# EAGLE design pcb_main (EAGLE 9.6.2)
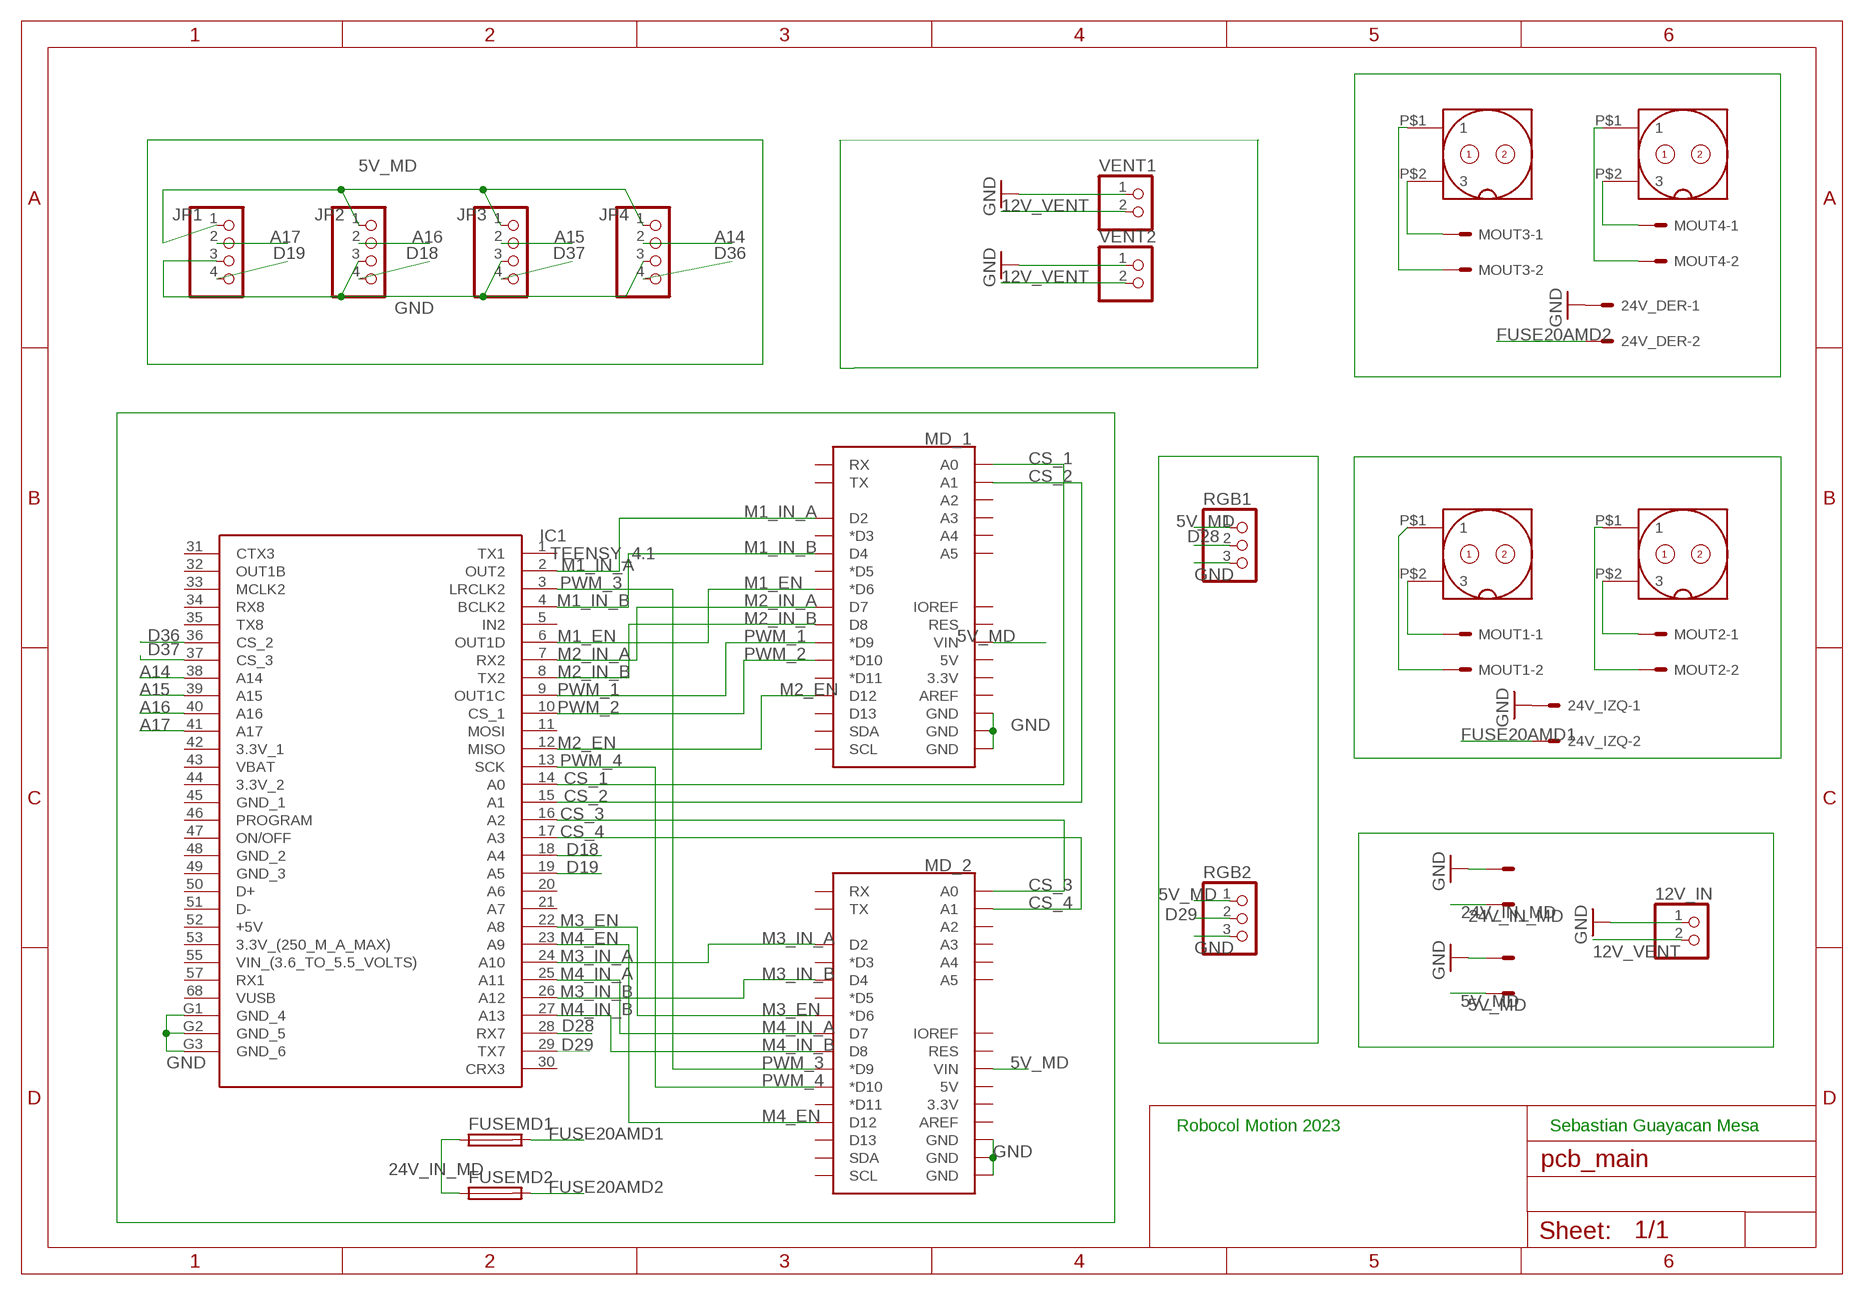
[diagram p0: schematic, sheet 1]

## Parts
5_MD  5566-25569-2  [5569-2]
12V_IN  PINHD-1X2  [1X02]
24V_DER  5566-25569-2  [5569-2]
24V_IZQ  5566-25569-2  [5569-2]
24V_MD  5566-25569-2  [5569-2]
FUSEMD1  FUSEBLANK_5X20MM  [FUSE_HOLDER_5X20MM]
FUSEMD2  FUSEBLANK_5X20MM  [FUSE_HOLDER_5X20MM]
IC1  TEENSY_4.1  [TEENSY41]
JP1  PINHD-1X4  [1X04]
JP2  PINHD-1X4  [1X04]
JP3  PINHD-1X4  [1X04]
JP4  PINHD-1X4  [1X04]
M1  GX16_2_PINS  [GX16_2_PINS_PADS]
M2  GX16_2_PINS  [GX16_2_PINS_PADS]
M3  GX16_2_PINS  [GX16_2_PINS_PADS]
M4  GX16_2_PINS  [GX16_2_PINS_PADS]
MD_1  ARDUINO_UNO_R3_SHIELDBASIC  [UNO_R3_SHIELD]
MD_2  ARDUINO_UNO_R3_SHIELDBASIC  [UNO_R3_SHIELD]
MOUT1  5566-25569-2  [5569-2]
MOUT2  5566-25569-2  [5569-2]
MOUT3  5566-25569-2  [5569-2]
MOUT4  5566-25569-2  [5569-2]
RGB1  PINHD-1X3  [1X03]
RGB2  PINHD-1X3  [1X03]
VENT1  PINHD-1X2  [1X02]
VENT2  PINHD-1X2  [1X02]

## Nets
5V_MD: 5_MD.2 JP1.1 JP2.1 JP3.1 JP4.1 MD_1.VIN MD_2.VIN RGB1.1 RGB2.1
12V_VENT: 12V_IN.2 VENT1.2 VENT2.2
24V_IN_MD: 24V_MD.2 FUSEMD1.1 FUSEMD2.1
A14: IC1.38(A14) JP4.2
A15: IC1.39(A15) JP3.2
A16: IC1.40(A16) JP2.2
A17: IC1.41(A17) JP1.2
CS_1: IC1.14(A0) MD_1.A0
CS_2: IC1.15(A1) MD_1.A1
CS_3: IC1.16(A2) MD_2.A0
CS_4: IC1.17(A3) MD_2.A1
D18: IC1.18(A4) JP2.4
D19: IC1.19(A5) JP1.4
D28: IC1.28(RX7) RGB1.2
D29: IC1.29(TX7) RGB2.2
D36: IC1.36(CS_2) JP4.4
D37: IC1.37(CS_3) JP3.4
FUSE20AMD1: 24V_IZQ.2 FUSEMD1.2
FUSE20AMD2: 24V_DER.2 FUSEMD2.2
GND: 5_MD.1 12V_IN.1 24V_DER.1 24V_IZQ.1 24V_MD.1 IC1.G1(GND_4) IC1.G2(GND_5) IC1.G3(GND_6) JP1.3 JP2.3 JP3.3 JP4.3 MD_1.GND@0(GND) MD_1.GND@1(GND) MD_1.GND@2(GND) MD_2.GND@0(GND) MD_2.GND@1(GND) MD_2.GND@2(GND) RGB1.3 RGB2.3 VENT1.1 VENT2.1
M1_EN: IC1.6(OUT1D) MD_1.D6(*D6)
M1_IN_A: IC1.2(OUT2) MD_1.D2
M1_IN_B: IC1.4(BCLK2) MD_1.D4
M2_EN: IC1.12(MISO) MD_1.D12
M2_IN_A: IC1.7(RX2) MD_1.D7
M2_IN_B: IC1.8(TX2) MD_1.D8
M3_EN: IC1.22(A8) MD_2.D6(*D6)
M3_IN_A: IC1.24(A10) MD_2.D2
M3_IN_B: IC1.26(A12) MD_2.D4
M4_EN: IC1.23(A9) MD_2.D12
M4_IN_A: IC1.25(A11) MD_2.D7
M4_IN_B: IC1.27(A13) MD_2.D8
N$3: M1.P$2 MOUT1.1
N$4: M2.P$2 MOUT2.1
N$5: M2.P$1 MOUT2.2
N$6: M1.P$1 MOUT1.2
N$7: M4.P$2 MOUT4.1
N$8: M4.P$1 MOUT4.2
N$9: M3.P$2 MOUT3.1
N$10: M3.P$1 MOUT3.2
PWM_1: IC1.9(OUT1C) MD_1.D9(*D9)
PWM_2: IC1.10(CS_1) MD_1.D10(*D10)
PWM_3: IC1.3(LRCLK2) MD_2.D9(*D9)
PWM_4: IC1.13(SCK) MD_2.D10(*D10)
Unconnected: IC1.1(TX1) IC1.5(IN2) IC1.11(MOSI) IC1.20(A6) IC1.21(A7) IC1.30(CRX3) IC1.31(CTX3) IC1.32(OUT1B) IC1.33(MCLK2) IC1.34(RX8) IC1.35(TX8) IC1.42(3.3V_1) IC1.43(VBAT) IC1.44(3.3V_2) IC1.45(GND_1) IC1.46(PROGRAM) IC1.47(ON/OFF) IC1.48(GND_2) IC1.49(GND_3) IC1.50(D+) IC1.51(D-) IC1.52(+5V) IC1.53(3.3V_(250_M_A_MAX)) IC1.55(VIN_(3.6_TO_5.5_VOLTS)) IC1.57(RX1) IC1.68(VUSB) MD_1.3.3V MD_1.5V MD_1.A2 MD_1.A3 MD_1.A4 MD_1.A5 MD_1.AREF MD_1.D3(*D3) MD_1.D5(*D5) MD_1.D11(*D11) MD_1.D13 MD_1.IOREF MD_1.RES MD_1.RX MD_1.SCL MD_1.SDA MD_1.TX MD_2.3.3V MD_2.5V MD_2.A2 MD_2.A3 MD_2.A4 MD_2.A5 MD_2.AREF MD_2.D3(*D3) MD_2.D5(*D5) MD_2.D11(*D11) MD_2.D13 MD_2.IOREF MD_2.RES MD_2.RX MD_2.SCL MD_2.SDA MD_2.TX

## Notes on the sheet
- Robocol Motion 2023 | Sebastian Guayacan Mesa

## Library data of the parts
5_MD 24V_DER 24V_IZQ 24V_MD MOUT1-MOUT4 = molex_arreglado_2:5566-2: Mini FIT connector 2 pol Source: http://www.molex.com
12V_IN VENT1 VENT2 = pinhead:PINHD-1X2: PIN HEADER
FUSEMD1 FUSEMD2 = fuse:FUSE: Fuse; OC_FARNELL: unknown; OC_NEWARK: unknown
IC1 = TEENSY_4.1:TEENSY_4.1: Teensy 4.1 Development Board Source: Datasheet <https://www.pjrc.com/store/teensy41.html>; DESCRIPTION: Teensy 4.1 Development Board; HEIGHT: 4.07mm; MANUFACTURER_NAME: PJRC; MANUFACTURER_PART_NUMBER: TEENSY 4.1
JP1-JP4 = pinhead:PINHD-1X4: PIN HEADER
M1-M4 = Robocol_Eagle_Libraries2:GX16_2_PINS: GX19 Reference: GX19 2 pins Type: Male Connector. Description: Aviation connector use for power connections. Rated Current: 7A Maximum working Voltage: 250 V AC RMS Author: Franz Luepke. Year: 2020 Made for use in: Robocol Uniandes.
MD_1 MD_2 = SparkFun-Boards:ARDUINO_UNO_R3_SHIELD: Arduino R3 Shield Footprint Shield form compatible with the Arduino Uno R3. SparkFun Products: MG2639 Cellular Shield <https://www.sparkfun.com/products/13120> MIDI Shield <https://www.sparkfun.com/products/12898> R3 Stackable Headers Kit <https://www.sparkfun.com/products/11417>
RGB1 RGB2 = pinhead:PINHD-1X3: PIN HEADER

## Board
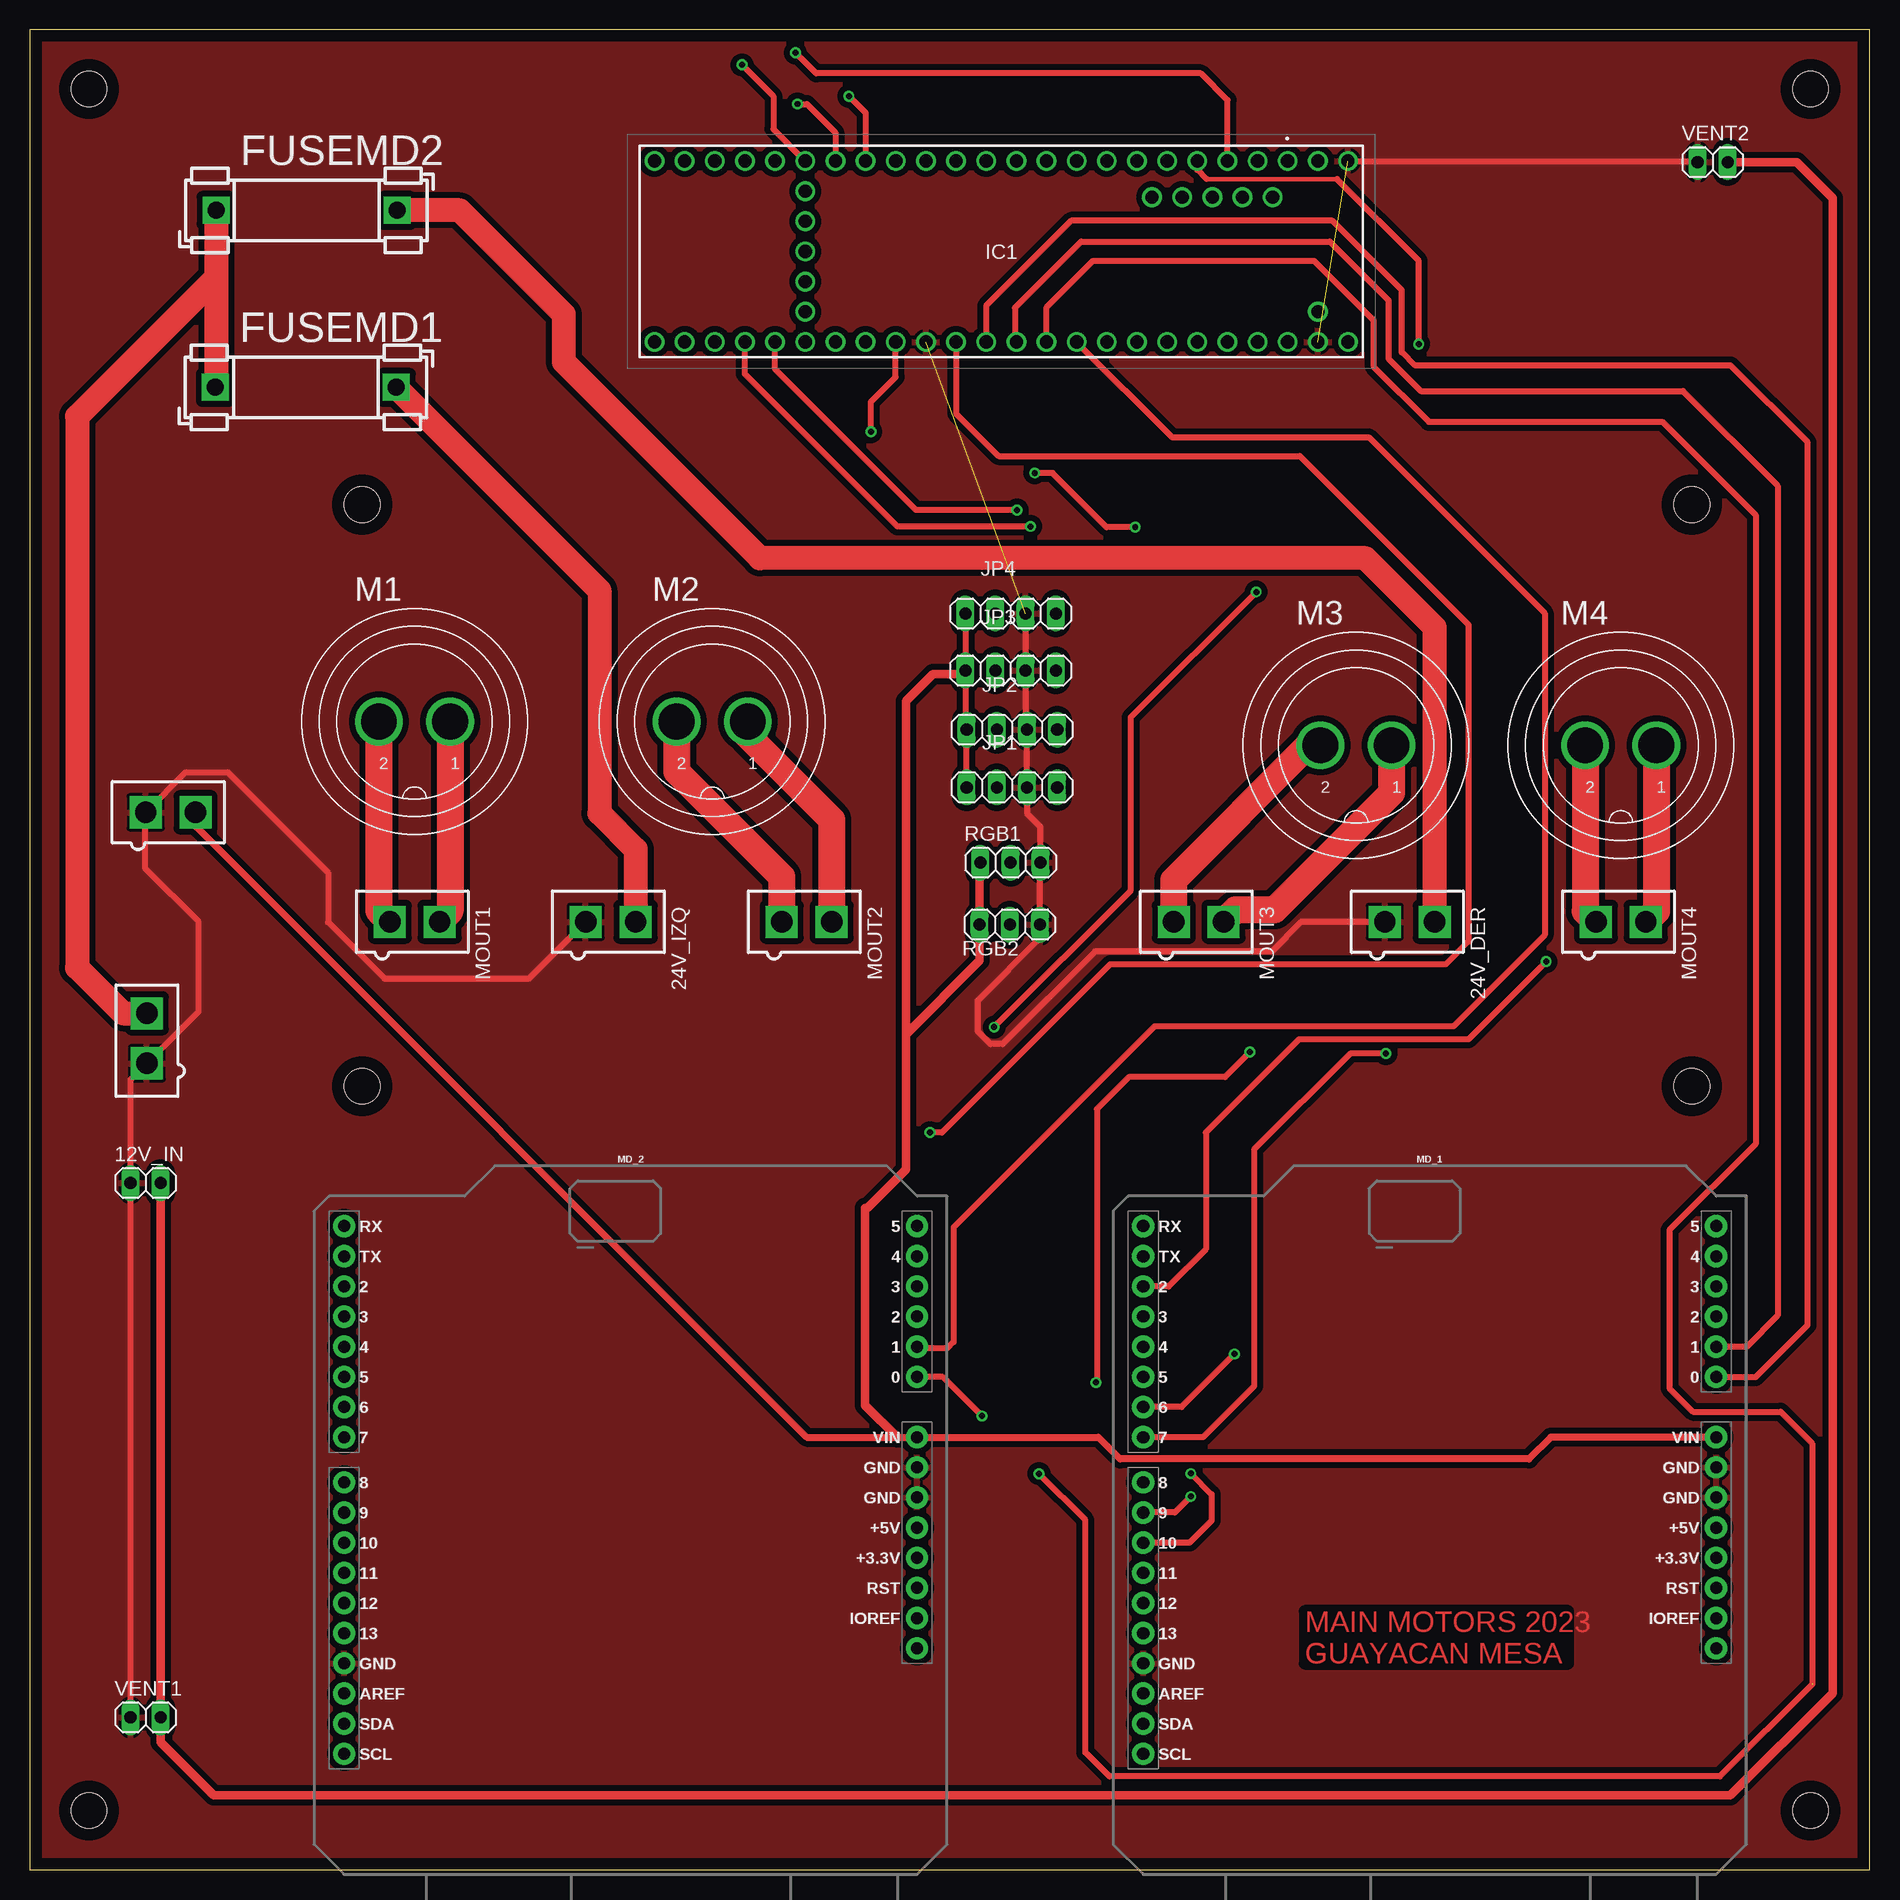
[diagram p1: board, top side]
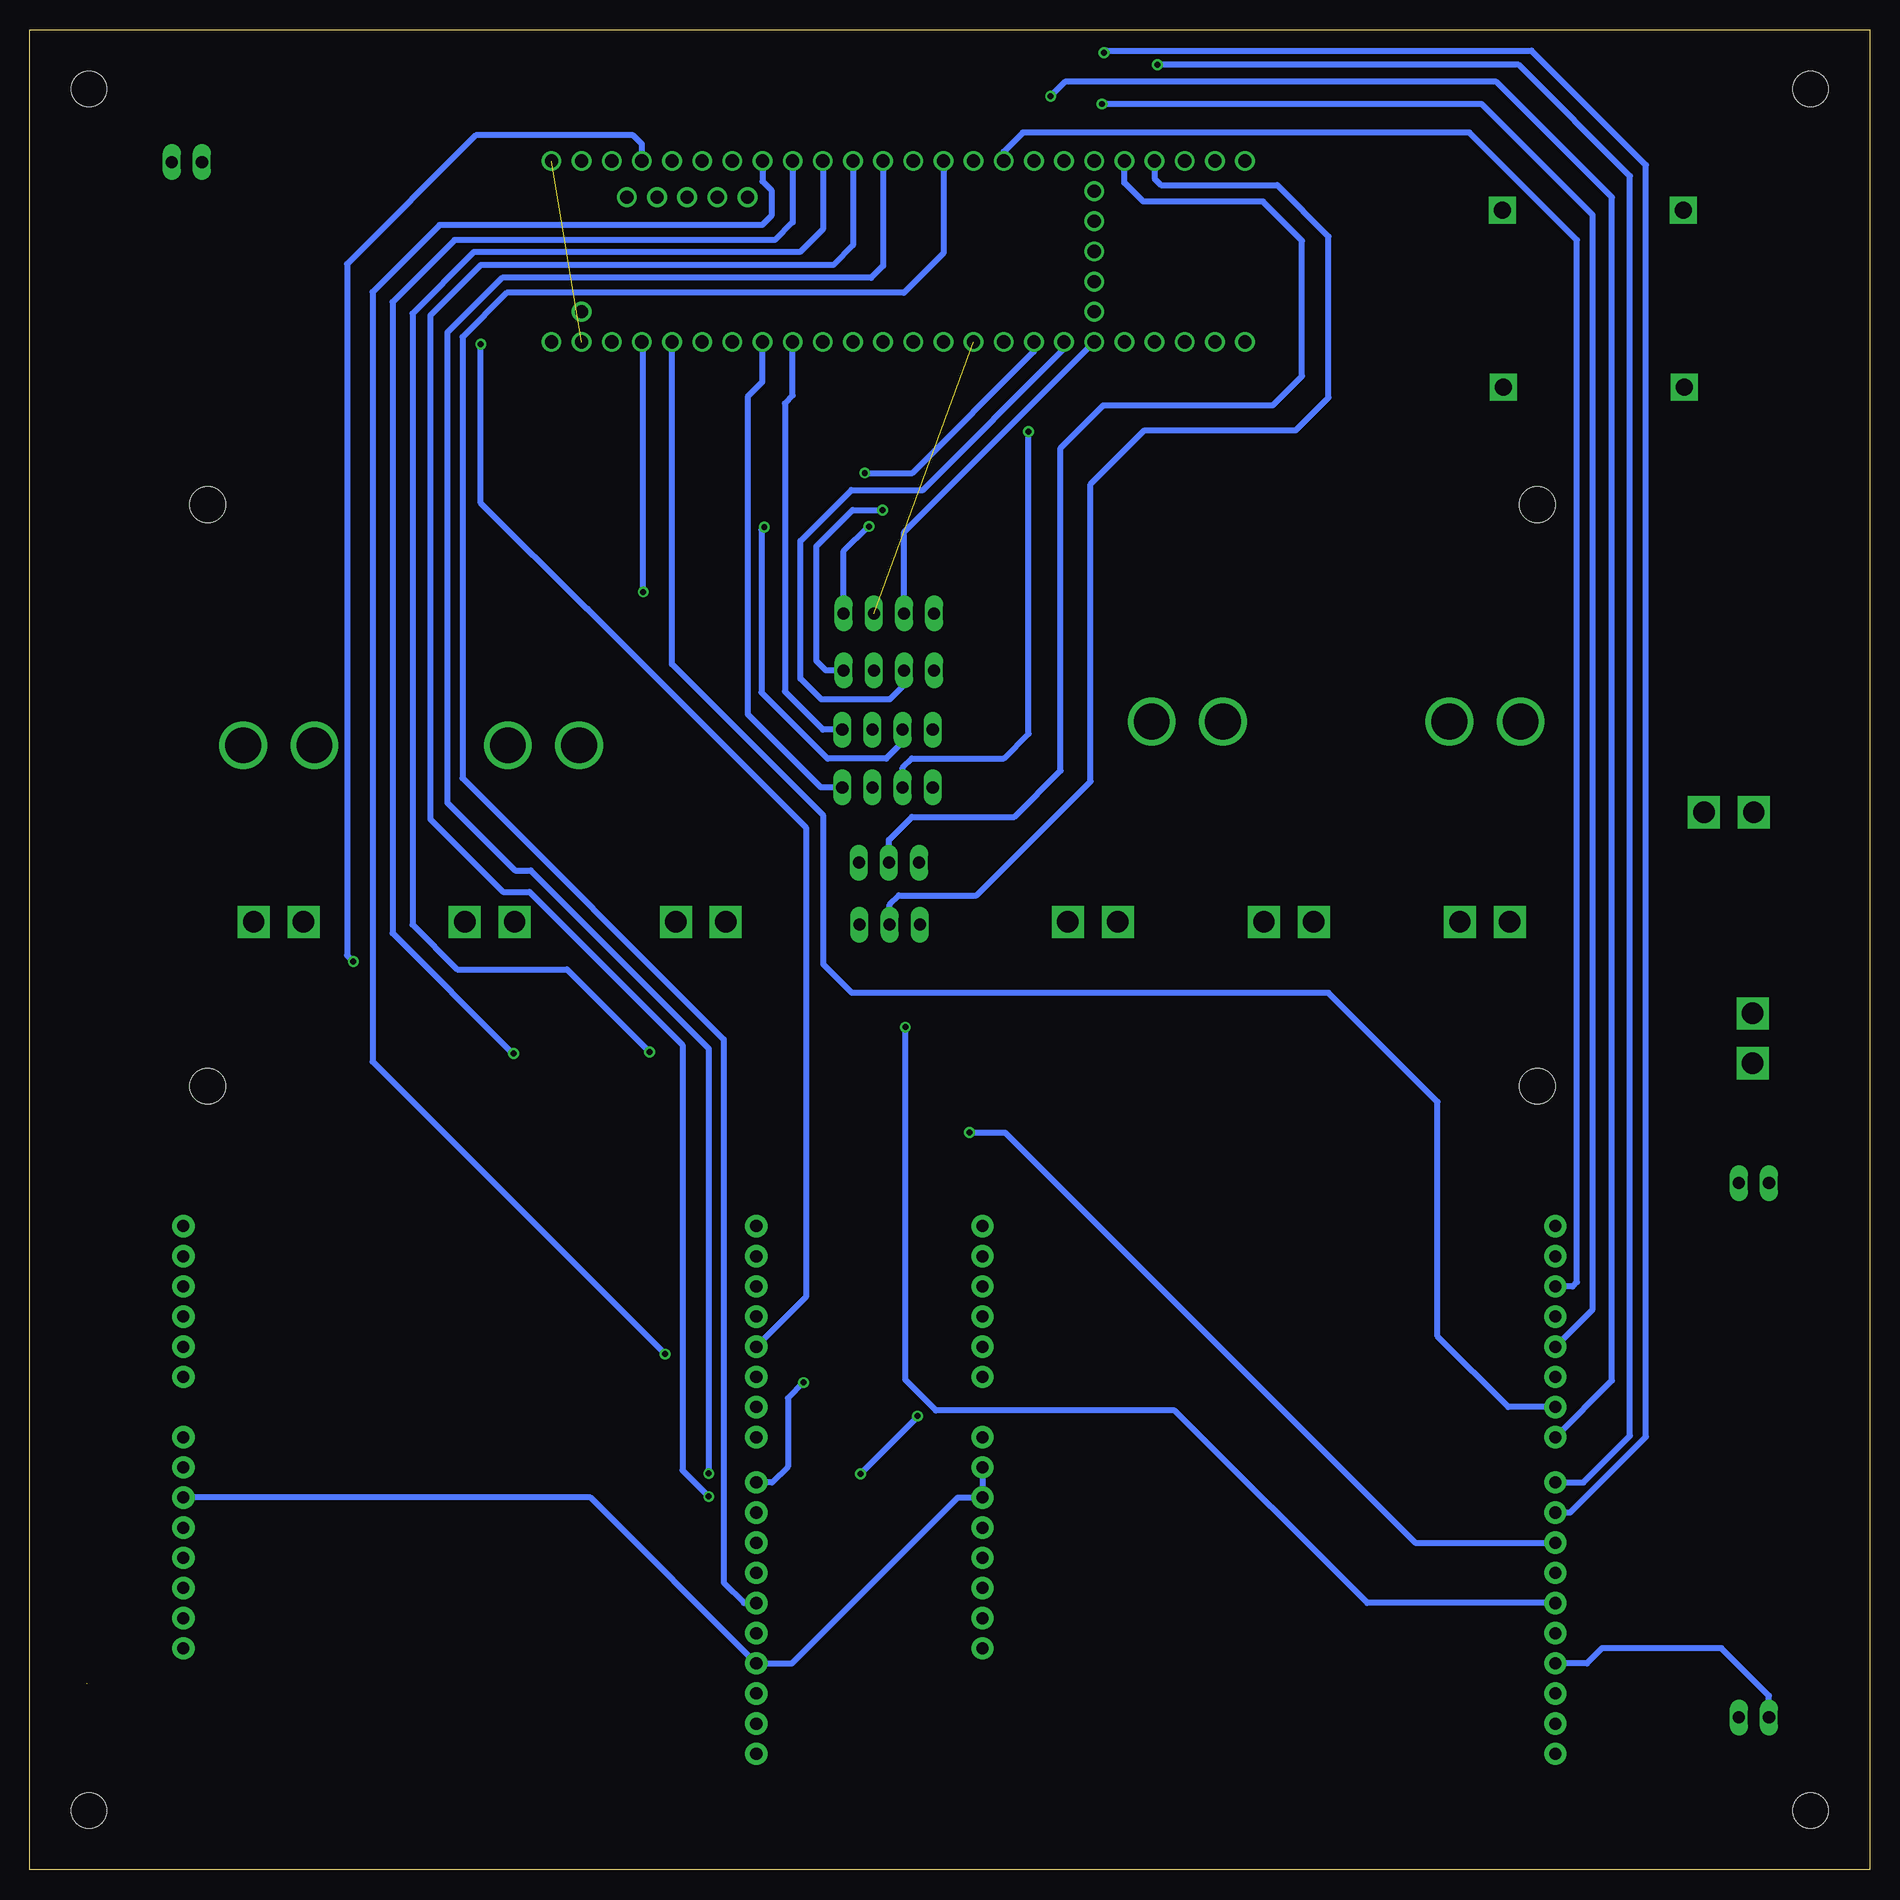
[diagram p2: board, bottom side, seen from below]

Size 155 x 155 mm. Coordinates in mm from the lower left corner, seen from the top.
Outline: 0,0 155,0 155,155 0,155 0,0
Copper layers (1*16): Top 0.035mm / dielectric 1.5mm / Bottom 0.035mm
Design rules "default *": minimum track width 0.35mm, minimum drill 0.5mm, track to track 0.5mm, track to pad 0.5mm, pad to pad 0.5mm, via to via 0.5mm, smd to smd 0.5mm, copper to edge 40mil, drill to drill 0.5mm, minimum pad ring 10mil, minimum via ring 8mil, stop-mask expansion 15.75mil, vias tented up to drill 0mil, thermal gap 10mil
Holes 3 mm at 5,150 150,150 5,5 150,5 140,66 28,66 140,115 28,115

### Footprints (pad centres in the part's own frame; a part is rotated, then mirrored left to right if it is on the bottom)
5569-2 = drill 1.8 square: 1 0,-2.1; 2 0,2.1
1X02 = drill 1.016 long: 1 -1.27,0; 2 1.27,0
FUSE_HOLDER_5X20MM = drill 1.422 pad 2.286 square: 1 0,0; 2 15.24,0
TEENSY41 = drill 1.11 pad 1.665: 1 0,0; 2 2.54,0; 3 5.08,0; 4 7.62,0; 5 10.16,0; 6 12.7,0; 7 15.24,0; 8 17.78,0; 9 20.32,0; 10 22.86,0; 11 25.4,0; 12 27.94,0; 13 27.94,15.24; 14 25.4,15.24; 15 22.86,15.24; 16 20.32,15.24; 17 17.78,15.24; 18 15.24,15.24; 19 12.7,15.24; 20 10.16,15.24; 21 7.62,15.24; 22 5.08,15.24; 23 2.54,15.24; 24 33.02,0; 25 35.56,0; 26 38.1,0; 27 40.64,0; 28 43.18,0; 29 45.72,0; 30 48.26,0; 31 50.8,0; 32 53.34,0; 33 53.34,15.24; 34 50.8,15.24; 35 48.26,15.24; 36 45.72,15.24; 37 43.18,15.24; 38 40.64,15.24; 39 38.1,15.24; 40 35.56,15.24; 41 33.02,15.24; 42 30.48,0; 43 40.64,2.54; 44 40.64,5.08; 45 40.64,7.62; 46 40.64,10.16; 47 40.64,12.7; 48 11.43,3.05; 49 8.89,3.05; 50 6.35,3.05; 51 3.81,3.05; 52 1.27,3.05; 53 0,15.24; 55 -5.08,15.24; 57 -2.54,0; 68 -2.54,12.7; G1 30.48,15.24; G2 -2.54,15.24; G3 -5.08,0
1X04 = drill 1.016 long: 1 -3.81,0; 2 -1.27,0; 3 1.27,0; 4 3.81,0
GX16_2_PINS_PADS = drill 3 pad 4: P$1 3,0; P$2 -3,0
UNO_R3_SHIELD = drill 1.016 pad 1.88: 3.3V 24.13,-2.54; 5V 24.13,0; A0 24.13,12.7; A1 24.13,15.24; A2 24.13,17.78; A3 24.13,20.32; A4 24.13,22.86; A5 24.13,25.4; AREF -24.13,-13.97; D2 -24.13,20.32; D3 -24.13,17.78; D4 -24.13,15.24; D5 -24.13,12.7; D6 -24.13,10.16; D7 -24.13,7.62; D8 -24.13,3.81; D9 -24.13,1.27; D10 -24.13,-1.27; D11 -24.13,-3.81; D12 -24.13,-6.35; D13 -24.13,-8.89; GND@0 24.13,2.54; GND@1 24.13,5.08; GND@2 -24.13,-11.43; IOREF 24.13,-7.62; NC 24.13,-10.16; RES 24.13,-5.08; RX -24.13,25.4; SCL -24.13,-19.05; SDA -24.13,-16.51; TX -24.13,22.86; VIN 24.13,7.62
1X03 = drill 1.016 long: 1 -2.54,0; 2 0,0; 3 2.54,0

### Placement (x,y rotation side)
5_MD  11.87,89.08 270 top
12V_IN  9.76,57.85 0 top
24V_DER  116.25,79.85 270 top
24V_IZQ  48.94,79.85 270 top
24V_MD  9.87,70.04 0 top
FUSEMD1  15.64,124.88 0 top
FUSEMD2  15.7,139.78 0 top
IC1  105.97,143.94 180 top
JP1  82.74,91.18 0 top
JP2  82.74,96.04 0 top
JP3  82.62,101.02 0 top
JP4  82.62,105.82 0 top
M1  32.41,96.72 0 top
M2  57.49,96.72 0 top
M3  111.72,94.72 0 top
M4  134.02,94.72 0 top
MD_1  117.93,28.82 0 top
MD_2  50.62,28.82 0 top
MOUT1  32.43,79.85 270 top
MOUT2  65.45,79.85 270 top
MOUT3  98.47,79.85 270 top
MOUT4  134.03,79.85 270 top
RGB1  82.62,84.84 0 top
RGB2  82.56,79.62 0 top
VENT1  9.76,12.84 0 top
VENT2  141.76,143.85 0 top

### Tracks (layer width: path | path; a pad name or v marks a point on that pad's centre or on a via)
5V_MD
  Top 0.5: JP4.1 JP3.1 | JP3.1 78.81,100.74 | JP1.1 JP2.1 78.81,96.16 JP3.1
  Top 0.61: 5_MD.2 13.97,88.24 14.05,88.16 14.05,87.84 65.45,36.44 73.08,36.44 MD_2.VIN 90.01,36.44 91.84,34.61 126.29,34.61 128.12,36.44 MD_1.VIN
  Top 0.711: 78.93,100.74 78.81,100.74 76.08,100.74 73.8,98.46 73.8,70.38 | 73.8,70.38 73.8,58.98 70.56,55.74 70.38,55.74 70.38,39.14 73.08,36.44 | RGB1.1 80.02,84.78 RGB2.1 80.02,76.6 73.8,70.38
12V_VENT
  Top 0.711: 12V_IN.2 VENT1.2 11.03,10.73 15.49,6.27 143.25,6.27 151.86,14.88 151.86,140.82 148.86,143.82 143.06,143.82 VENT2.2
24V_IN_MD
  Top 2.032: FUSEMD2.1 15.7,134.12 | FUSEMD1.1 15.7,124.94 15.7,134.12 | 15.7,134.12 4,122.42 4,76 7.86,72.14 24V_MD.2
A14
  Bottom 0.5: JP4.2 81.35,112.69 IC1.38
A15
  Bottom 0.5: JP3.2 81.48,100.89 81.48,99.66 82.56,98.58 88.32,98.58 90.08,100.34 90.08,111.94 85.78,116.24 79.74,116.24 67.87,128.11 IC1.39
A16  (via drill 0.5)
  Top 0.5: v93.12,113.1 90.72,113.1 86.16,117.66 v84.66,117.66
  Bottom 0.5: IC1.40 70.44,128.67 70.44,127.86 80.64,117.66 v84.66,117.66 | JP2.2 81.47,94.99 82.86,93.6 87.78,93.6 93.36,99.18 93.36,112.86 v93.12,113.1
A17  (via drill 0.5)
  Top 0.5: v70.86,121.14 70.86,123.66 72.95,125.75 IC1.41
  Bottom 0.5: JP1.2 81.47,92.83 80.68,93.62 72.94,93.62 70.86,95.7 v70.86,121.14
CS_1
  Top 0.5: MD_1.A0 145.38,41.52 149.76,45.9 149.76,120.24 143.28,126.72 116.68,126.72 115.58,127.82 115.58,133.06 109.74,138.9 87.72,138.9 80.57,131.75 IC1.14
CS_2
  Top 0.5: IC1.15 82.99,128.82 82.99,131.58 88.57,137.16 109.5,137.16 114.46,132.2 114.46,127.28 117.18,124.56 139.26,124.56 147.24,116.58 147.24,46.68 144.62,44.06 MD_1.A1
CS_3  (via drill 0.5)  (1 unrouted)
  Top 0.5: IC1.16 85.65,131.61 89.58,135.54 108.18,135.54 113.2,130.52 113.2,126.62 117.84,121.98 137.52,121.98 145.38,114.12 145.38,61.14 138.12,53.88 138.12,40.56 140.1,38.58 147.48,38.58 150.14,35.92 150.14,15.65 | v85.02,33.36 88.92,29.46 88.92,9.9 90.96,7.86 142.38,7.86 150.18,15.66 | v80.22,38.22 76.92,41.52 MD_2.A0
  Bottom 0.5: v85.02,33.36 80.22,38.16 v80.22,38.22
CS_4
  Top 0.5: MD_2.A1 74.87,43.93 77.3,43.93 77.82,44.45 77.82,54.11 94.75,71.04 119.93,71.04 127.62,78.73 127.62,105.84 112.8,120.66 96.23,120.66 IC1.17
D18
  Bottom 0.5: JP2.4 88.18,96.04 91.39,99.25 91.39,123.54 90.73,124.2 IC1.18
D19
  Bottom 0.5: JP1.4 88.36,91.18 94.53,97.35 94.53,124.08 93.27,125.34 IC1.19
D28
  Bottom 0.5: RGB1.2 82.62,86.76 80.7,88.68 72.06,88.68 68.16,92.58 68.16,119.76 64.56,123.36 50.28,123.36 47.82,125.82 47.82,137.22 51.12,140.52 61.2,140.52 62.79,142.11 IC1.28
D29
  Bottom 0.5: RGB2.2 82.56,81.3 81.78,82.08 75.24,82.08 65.64,91.68 65.64,116.7 61.08,121.26 48.36,121.26 45.6,124.02 45.6,137.58 49.92,141.9 59.7,141.9 60.25,142.45 IC1.29
D36  (via drill 0.5)
  Top 0.5: v84.3,113.16 73.08,113.16 60.25,125.99 IC1.36
  Bottom 0.5: JP4.4 86.43,111.09 84.36,113.16 v84.3,113.16
D37  (via drill 0.5)
  Top 0.5: v83.16,114.54 74.64,114.54 62.79,126.39 IC1.37
  Bottom 0.5: JP3.4 87.93,101.02 88.74,101.83 88.74,111.48 85.68,114.54 v83.16,114.54
FUSE20AMD1
  Top 2.032: 24V_IZQ.2 51.04,85.96 48,89 48,107.76 FUSEMD1.2
FUSE20AMD2
  Top 2.032: 24V_DER.2 118.34,79.86 118.34,104.66 112.52,110.48 61.52,110.48 45,127 45,131 36.22,139.78 FUSEMD2.2
GND  (2 unrouted)
  Top 0.5: IC1.G3 140.4,143.94 VENT2.1 | VENT1.1 12V_IN.1 8.49,66.56 24V_MD.1 14.22,72.29 14.22,79.86 9.72,84.36 9.72,89.03 5_MD.1 13.15,92.46 16.68,92.46 25.14,84 25.14,79.82 29.89,75.07 42.06,75.07 24V_IZQ.1 | 85.1,84.78 RGB2.3 85.1,78.48 79.87,73.25 79.87,70.63 80.94,69.56 81.96,69.56 89.77,77.37 104.62,77.37 107.1,79.85 24V_DER.1 | 85.1,84.78 RGB1.3 | 85.1,84.78 85.1,87.88 84.01,88.97 JP1.3 JP2.3 83.89,96.16 JP3.3 JP4.3
  Bottom 0.5: MD_1.GND@0 107.77,31.36 MD_1.GND@2 90.79,17.39 76.82,31.36 MD_2.GND@0 MD_2.GND@1 | VENT1.1 8.49,14.66 12.49,18.66 22.56,18.66 23.83,17.39 MD_2.GND@2
  pour Top: 0.3,154.74 0.3,0.36 154.62,0.36 154.62,154.74
M1_EN  (via drill 0.5)
  Top 0.5: v101.48,43.44 97.02,38.98 MD_1.D6
  Bottom 0.5: IC1.6 93.27,142.23 92.52,141.48 92.52,139.32 93.3,138.54 120.48,138.54 126.12,132.9 126.12,68.08 v101.48,43.44
M1_IN_A  (via drill 0.5)
  Top 0.5: v127.74,76.5 121.2,69.96 106.92,69.96 99.06,62.1 99.06,52.26 95.94,49.14 MD_1.D2
  Bottom 0.5: IC1.2 103.43,145.37 104.16,146.1 117.42,146.1 128.26,135.26 128.26,77.02 v127.74,76.5
M1_IN_B  (via drill 0.5)
  Top 0.38: 110.13,142.41 99.12,142.41
  Top 0.5: 110.13,142.41 117,135.54 v117,128.52 | IC1.4 98.35,143.19 99.12,142.41
  Bottom 0.5: MD_1.D4 89.61,48.25 89.61,87.81 108,106.2 108.06,106.2 117,115.14 v117,128.52
M2_EN
  Bottom 0.5: IC1.12 78.03,136.17 81.36,132.84 114.82,132.84 118.54,129.12 118.54,91.96 96.54,69.96 96.54,24.18 94.83,22.47 MD_1.D12
M2_IN_A  (via drill 0.5)
  Top 0.5: v114.24,68.76 111.24,68.76 103.14,60.66 103.14,40.74 98.84,36.44 MD_1.D7
  Bottom 0.5: IC1.7 90.73,138.77 92.22,137.28 119.22,137.28 124.44,132.06 124.44,78.9 114.48,68.94 114.42,68.94 v114.24,68.76
M2_IN_B  (via drill 0.5)
  Top 0.5: v102.78,68.88 100.68,66.78 92.58,66.78 89.88,64.08 89.88,41.04 v89.82,41.04
  Bottom 0.5: IC1.8 88.19,138.19 90.12,136.26 117.6,136.26 122.76,131.1 122.76,79.62 118.98,75.84 109.74,75.84 v102.78,68.88 | v89.82,41.04 91.14,39.72 91.14,33.96 92.47,32.63 MD_1.D8
M3_EN
  Bottom 0.5: MD_2.D6 30.46,38.98 36.42,44.94 36.42,64.68 45.6,73.86 85.74,73.86 88.14,76.26 88.14,88.8 100.89,101.55 IC1.22
M3_IN_A
  Bottom 0.5: IC1.24 72.95,144.73 71.34,146.34 33.72,146.34 24.66,137.28 24.66,49.5 25.02,49.14 MD_2.D2
M3_IN_B  (via drill 0.5)
  Top 0.5: v64.68,148.74 65.46,148.74 67.87,146.33 IC1.26
  Bottom 0.5: MD_2.D4 23.34,47.21 23.34,139.38 32.7,148.74 v64.68,148.74
M4_EN  (via drill 0.5)
  Top 0.5: v81.24,70.98 92.76,82.5 92.76,97.08 v103.32,107.64
  Bottom 0.5: MD_2.D12 42.33,22.47 58.56,38.7 78.66,38.7 81.24,41.28 v81.24,70.98 | v103.32,107.64 103.32,128.59 IC1.23
M4_IN_A  (via drill 0.5)
  Top 0.5: v69,149.4 70.41,147.99 IC1.25
  Bottom 0.5: MD_2.D7 21.72,41.21 21.72,140.88 31.44,150.6 67.8,150.6 v69,149.4
M4_IN_B  (via drill 0.5)
  Top 0.5: v60,152.04 62.64,149.4 62.64,146.63 IC1.27
  Bottom 0.5: MD_2.D8 24.13,32.63 20.2,36.56 20.2,142.66 29.58,152.04 v60,152.04
N$3
  Top 2.286: M1.P$2 29.41,80.77 MOUT1.1
N$4
  Top 2.286: M2.P$2 54.49,92.51 63.35,83.65 MOUT2.1
N$5
  Top 2.286: MOUT2.2 67.55,88.45 60.49,95.51 M2.P$1
N$6
  Top 2.286: M1.P$1 35.41,80.74 MOUT1.2
N$7
  Top 2.286: M4.P$2 131.02,80.76 MOUT4.1
N$8
  Top 2.286: M4.P$1 137.02,80.74 MOUT4.2
N$9
  Top 2.286: MOUT3.1 96.37,83.37 107.72,94.72 M3.P$2
N$10
  Top 2.286: MOUT3.2 101.57,80.85 104.85,80.85 114.72,90.72 M3.P$1
PWM_1  (via drill 0.5)
  Top 0.5: v97.8,31.44 96.45,30.09 MD_1.D9
  Bottom 0.5: IC1.9 85.65,136.83 87.3,135.18 117,135.18 121.26,130.92 121.26,88.5 115.14,82.38 112.91,82.38 100.02,69.49 100.02,33.66 v97.8,31.44
PWM_2  (via drill 0.5)
  Top 0.5: v97.8,33.38 99.55,31.63 99.55,29.41 97.69,27.55 MD_1.D10
  Bottom 0.5: IC1.10 83.11,135.11 84.12,134.1 115.2,134.1 119.82,129.48 119.82,89.88 114.12,84.18 112.8,84.18 97.8,69.18 v97.8,33.38
PWM_3  (via drill 0.5)
  Top 0.5: IC1.3 100.89,149.07 98.64,151.32 66.24,151.32 v64.5,153.06
  Bottom 0.5: MD_2.D9 25.23,30.09 18.85,36.47 18.85,143.59 28.5,153.24 64.32,153.24 v64.5,153.06
PWM_4  (via drill 0.5)
  Top 0.5: IC1.13 78.03,122.67 81.6,119.1 106.98,119.1 121.2,104.88 121.2,78.18 119.28,76.26 91,76.26 76.84,62.1 v75.84,62.1
  Bottom 0.5: v75.84,62.1 72.84,62.1 38.29,27.55 MD_2.D10

### Text on the board
Top: MAIN MOTORS 2023 / GUAYACAN MESA